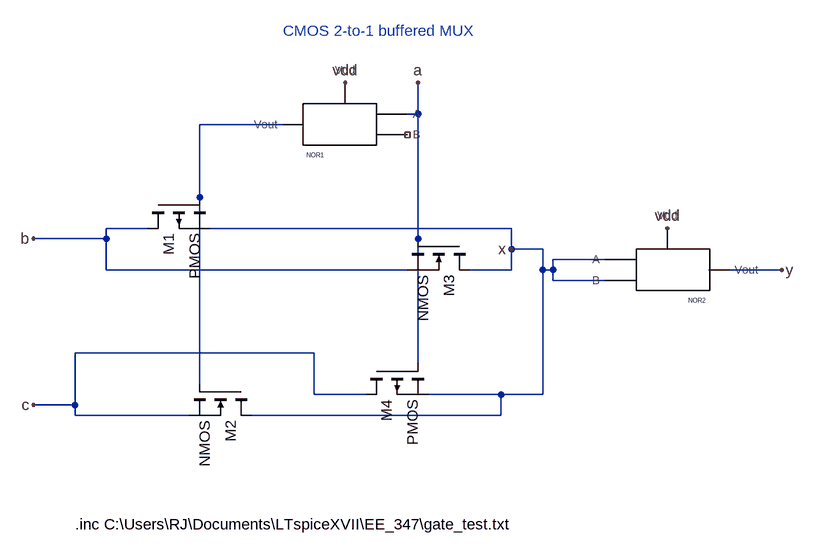
[diagram p0: schematic cmos_2t1_buf_mux.asc]
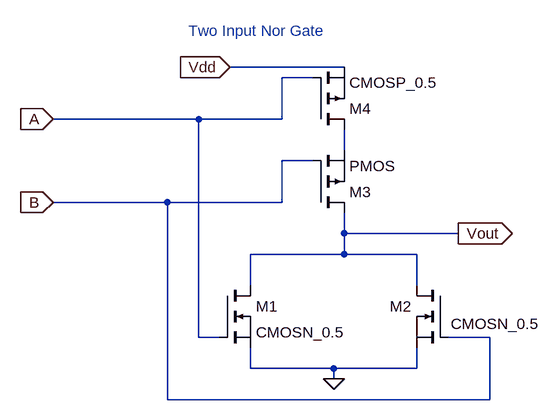
[diagram p1: sub-circuit my_nor.asc]
cmos_2t1_buf_mux.asc, the LTspice schematic file:
Version 4
SHEET 1 928 680
WIRE 336 -320 336 -368
WIRE 336 -320 320 -320
WIRE 128 -304 0 -304
WIRE 0 -192 0 -304
WIRE -80 -144 -144 -144
WIRE 480 -144 16 -144
WIRE -144 -128 -144 -144
WIRE -144 -128 -256 -128
WIRE 336 -128 336 -320
WIRE 480 -112 480 -144
WIRE 528 -112 480 -112
WIRE 624 -96 544 -96
WIRE -144 -80 -144 -128
WIRE 320 -80 -144 -80
WIRE 480 -80 480 -112
WIRE 480 -80 416 -80
WIRE 528 -80 528 -112
WIRE 544 -80 544 -96
WIRE 544 -80 528 -80
WIRE 896 -80 816 -80
WIRE 544 -64 544 -80
WIRE 624 -64 544 -64
WIRE 176 48 -192 48
WIRE 336 64 336 -128
WIRE 0 96 0 -192
WIRE 176 112 176 48
WIRE 256 112 176 112
WIRE 464 112 352 112
WIRE 528 112 528 -80
WIRE 528 112 464 112
WIRE -192 128 -192 48
WIRE -192 128 -256 128
WIRE -192 144 -192 128
WIRE -16 144 -192 144
WIRE 464 144 464 112
WIRE 464 144 80 144
FLAG 336 -368 a
FLAG -256 -128 b
FLAG -256 128 c
FLAG 480 -112 x
FLAG 896 -80 y
FLAG 720 -144 vdd
FLAG 224 -368 vdd
SYMBOL pmos -80 -192 M90
SYMATTR InstName M1
SYMBOL nmos 80 96 R90
SYMATTR InstName M2
SYMBOL nmos 416 -128 R90
SYMATTR InstName M3
SYMBOL pmos 256 64 M90
SYMATTR InstName M4
SYMBOL my_nor 224 -304 M0
SYMATTR InstName NOR1
SYMBOL my_nor 720 -80 R0
SYMATTR InstName NOR2
TEXT -192 312 Left 2 !.inc C:\\Users\\RJ\\Documents\\LTspiceXVII\\EE_347\\gate_test.txt
TEXT 128 -448 Left 2 ;CMOS 2-to-1 buffered MUX

my_nor.asc, the sub-circuit schematic file:
Version 4
SHEET 1 880 680
WIRE 336 -240 160 -240
WIRE 288 -224 240 -224
WIRE 112 -160 -112 -160
WIRE 240 -160 240 -224
WIRE 240 -160 112 -160
WIRE 336 -112 336 -144
WIRE 288 -96 240 -96
WIRE 64 -32 -112 -32
WIRE 240 -32 240 -96
WIRE 240 -32 64 -32
WIRE 336 16 336 -16
WIRE 512 16 336 16
WIRE 336 48 336 16
WIRE 336 48 192 48
WIRE 448 48 336 48
WIRE 192 96 192 48
WIRE 448 96 448 48
WIRE 112 176 112 -160
WIRE 144 176 112 176
WIRE 560 176 496 176
WIRE 192 224 192 192
WIRE 320 224 192 224
WIRE 448 224 448 192
WIRE 448 224 320 224
WIRE 320 240 320 224
WIRE 64 272 64 -32
WIRE 560 272 560 176
WIRE 560 272 64 272
FLAG -112 -32 B
IOPIN -112 -32 In
FLAG -112 -160 A
IOPIN -112 -160 In
FLAG 160 -240 Vdd
IOPIN 160 -240 In
FLAG 512 16 Vout
IOPIN 512 16 Out
FLAG 320 240 0
SYMBOL nmos 144 96 R0
SYMATTR InstName M1
SYMATTR Value CMOSN_0.5
SYMBOL nmos 496 96 M0
WINDOW 3 -141 59 Left 2
SYMATTR Value CMOSN_0.5
SYMATTR InstName M2
SYMBOL pmos 288 -144 M180
SYMATTR InstName M4
SYMATTR Value CMOSP_0.5
SYMBOL pmos 288 -16 M180
SYMATTR InstName M3
TEXT 96 -296 Left 2 ;Two Input Nor Gate

The netlist it stands for:
* cmos_2t1_buf_mux.asc
M1 b N001 x x PMOS
M2 x N001 c c NMOS
M3 x a b b NMOS
M4 c a x x PMOS
XNOR1 a NC_01 N001 vdd my_nor
XNOR2 x x y vdd my_nor

* block symbol definitions
.subckt my_nor A B Vout Vdd
M1 Vout A 0 0 CMOSN_0.5
M2 Vout B 0 0 CMOSN_0.5
M4 N001 A Vdd Vdd CMOSP_0.5
M3 Vout B N001 N001 PMOS
* Two Input Nor Gate
.ends my_nor

.model NMOS NMOS
.model PMOS PMOS
.lib standard.mos
.inc C:\Users\RJ\Documents\LTspiceXVII\EE_347\gate_test.txt
* CMOS 2-to-1 buffered MUX
.backanno
.end